# Altium project NI_ELVIS.PrjPCB
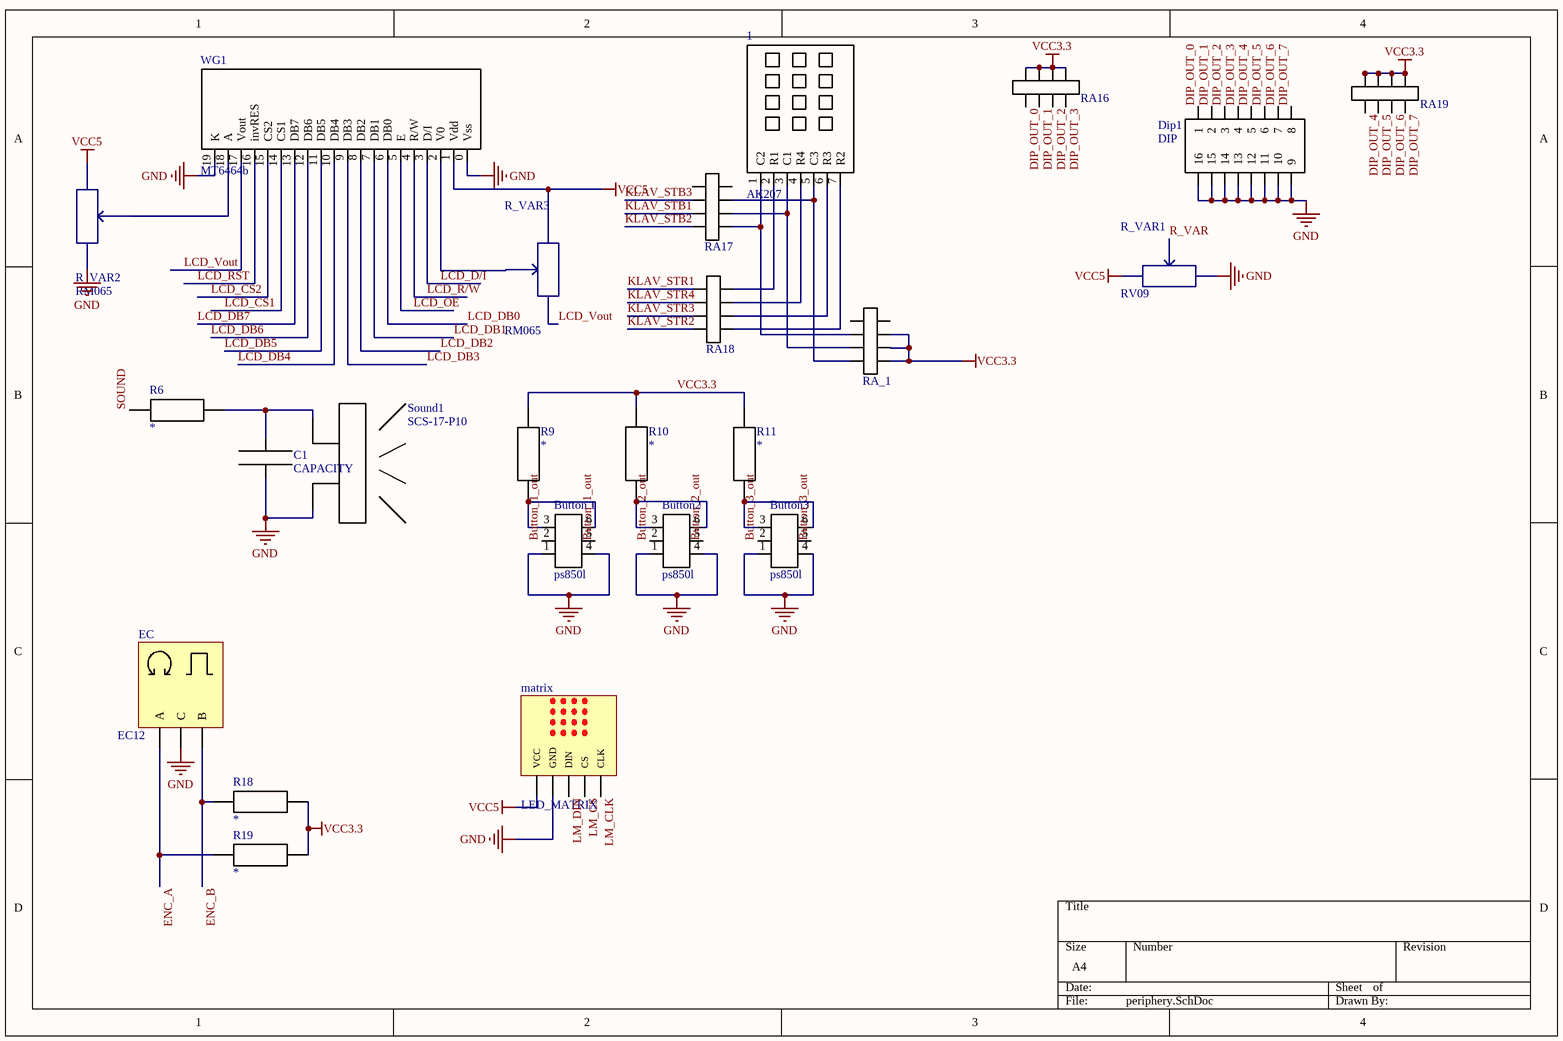
[diagram p0: periphery.SchDoc]
6 sheets, 90 parts. Net scope: global (net labels, ports and power ports of the same name join across sheets).
Board file: main_board.PcbDoc
Sheets:
  periphery.SchDoc
  power.SchDoc
  board_ports.SchDoc
  elv_connector.SchDoc
  7SEG.SchDoc
  main_connector.SchDoc

## Sheet periphery.SchDoc
size A4

### Parts
1  AK207  [AK-207]
Button2  ps850l  [ps850l]
Button3  ps850l  [ps850l]
Button_1  ps850l  [ps850l]
C1  CAPACITY  [R0805]
Dip1  DIP  [SWD1-8]
EC  EC12  [EC]
matrix  LED_MATRIX  [LED_MATRIX]
R6  *  [R0805]
R9  *  [R0805]
R10  *  [R0805]
R11  *  [R0805]
R18  *  [R0805]
R19  *  [R0805]
R_VAR1  RV09  [RV09]
R_VAR2  RM065  [RM065]
R_VAR3  RM065  [RM065]
RA16  Bourns CAT16-102J4LF_1  [CAT16-102J4_NEW]  (value not drawn)
RA17  Bourns CAT16-102J4LF_1  [CAT16-102J4_NEW]  (value not drawn)
RA18  Bourns CAT16-102J4LF_1  [CAT16-102J4_NEW]  (value not drawn)
RA19  Bourns CAT16-102J4LF_1  [CAT16-102J4_NEW]  (value not drawn)
RA_1  Bourns CAT16-102J4LF_1  [CAT16-102J4_NEW]  (value not drawn)
Sound1  SCS-17-P10  [SCS-17-P10]
WG1  MT6464b  [WG12864A]

### Nets
GND: Button2.1 Button2.4 Button3.1 Button3.4 Button_1.1 Button_1.4 C1.1 Dip1.9 Dip1.10 Dip1.11 Dip1.12 Dip1.13 Dip1.14 Dip1.15 Dip1.16 EC.2(C) matrix.2(GND) R_VAR1.3 R_VAR2.3 Sound1.0 WG1.0(Vss) WG1.19(K)
VCC3.3: R9.1 R10.1 R11.1 R18.2 R19.2 RA16.0 RA16.1 RA16.2 RA16.3 RA19.0 RA19.1 RA19.2 RA19.3 RA_1.5 RA_1.6 RA_1.7
VCC5: matrix.1(VCC) R_VAR1.1 R_VAR2.1 R_VAR3.3 WG1.1(Vdd)
Button_1_out: Button_1.2 Button_1.5
Button_2_out: Button2.2 Button2.5
Button_3_out: Button3.2 Button3.5
DIP_OUT_0: Dip1.1 RA16.7
DIP_OUT_1: Dip1.2 RA16.6
DIP_OUT_2: Dip1.3 RA16.5
DIP_OUT_3: Dip1.4 RA16.4
DIP_OUT_4: Dip1.5 RA19.7
DIP_OUT_5: Dip1.6 RA19.6
DIP_OUT_6: Dip1.7 RA19.5
DIP_OUT_7: Dip1.8 RA19.4
ENC_A: EC.1(A) R19.1
ENC_B: EC.3(B) R18.1
KLAV_STB1: RA17.2
KLAV_STB2: RA17.3
KLAV_STB3: RA17.1
KLAV_STR1: RA18.0
KLAV_STR2: RA18.3
KLAV_STR3: RA18.2
KLAV_STR4: RA18.1
LCD_CS1: WG1.14(CS1)
LCD_CS2: WG1.15(CS2)
LCD_D/I: WG1.3(D/I)
LCD_DB0: WG1.6(DB0)
LCD_DB1: WG1.7(DB1)
LCD_DB2: WG1.8(DB2)
LCD_DB3: WG1.9(DB3)
LCD_DB4: WG1.10(DB4)
LCD_DB5: WG1.11(DB5)
LCD_DB6: WG1.12(DB6)
LCD_DB7: WG1.13(DB7)
LCD_OE: WG1.5(E)
LCD_R/W: WG1.4(R/W)
LCD_RST: WG1.16(invRES)
LCD_Vout: R_VAR3.1 WG1.17(Vout)
LM_CLK: matrix.5(CLK)
LM_CS: matrix.4(CS)
LM_DIN: matrix.3(DIN)
R_VAR: R_VAR1.2
SOUND: R6.1
Net1_1: 1.1(C2) RA17.4 RA_1.2
Net1_2: 1.2(R1) RA18.7
Net1_3: 1.3(C1) RA17.5 RA_1.1
Net1_4: 1.4(R4) RA18.6
Net1_5: 1.5(C3) RA17.6 RA_1.0
Net1_6: 1.6(R3) RA18.5
Net1_7: 1.7(R2) RA18.4
NetButton2_3: Button2.3 Button2.6 R10.2
NetButton3_3: Button3.3 Button3.6 R11.2
NetButton_1_3: Button_1.3 Button_1.6 R9.2
NetC1_2: C1.2 R6.2 Sound1.1
NetR_VAR2_2: R_VAR2.2 WG1.18(A)
NetR_VAR3_2: R_VAR3.2 WG1.2(V0)

Not connected (* = marked no-connect by the designer): RA17 0 7; RA_1 3 4

### Library data of the parts
1 = AK-207
EC = EC12: EC12 rotary encoder
matrix = LED_MATRIX: led matrix, max7219 driver
R6 R9-R11 R18 R19 = R0805: Resistance: *
R_VAR2 R_VAR3 = RM065: trimming potentiometer

## Sheet power.SchDoc
size A4
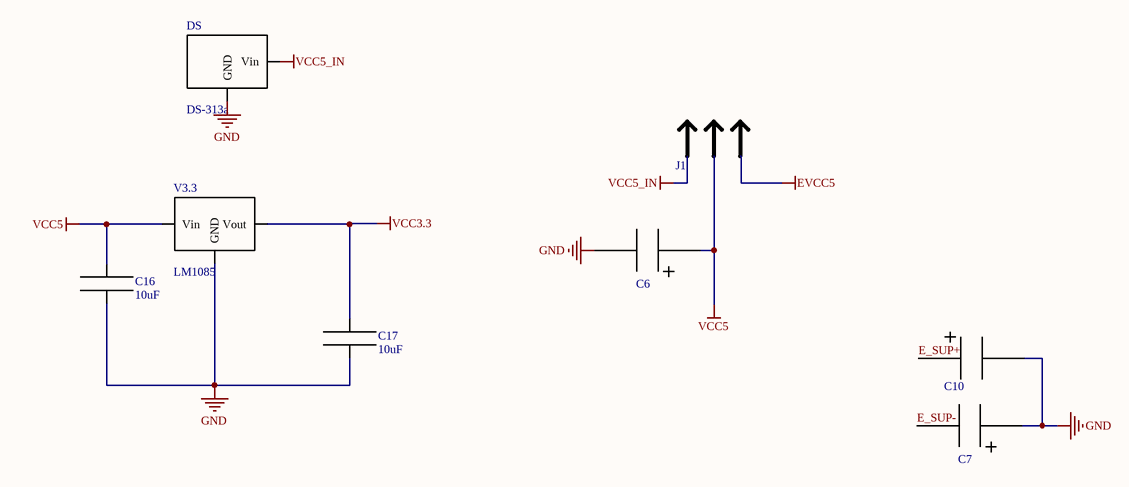
[diagram p1: power.SchDoc]

### Parts
C6  C_Ta  [C_Ta]  (value not drawn)
C7  C_Ta  [C_Ta]  (value not drawn)
C10  C_Ta  [C_Ta]  (value not drawn)
C16  10uF  [R0805]
C17  10uF  [R0805]
DS  DS-313a  [ds-313]
J1  JUMPER_SWITCH_2S  [JUMPER_SWITCH_2S]  (value not drawn)
V3.3  LM1085  [LM1085]

### Nets
EVCC5: J1.2
GND: C6.2 C7.1 C10.2 C16.2 C17.2 DS.0(GND) V3.3.0(GND)
VCC3.3: C17.1 V3.3.1(Vout)
VCC5: C6.1 C16.1 J1.0 V3.3.2(Vin)
VCC5_IN: DS.1(Vin) J1.1
E_SUP+: C10.1
E_SUP-: C7.2

### Library data of the parts
C6 C7 C10 = C_Ta: tantalum capacitor; capacity: *
C16 C17 = CAPACITY: Capacity: 10uF
J1 = JUMPER_SWITCH_2S: 2 state jumper switch

## Sheet board_ports.SchDoc
size A3
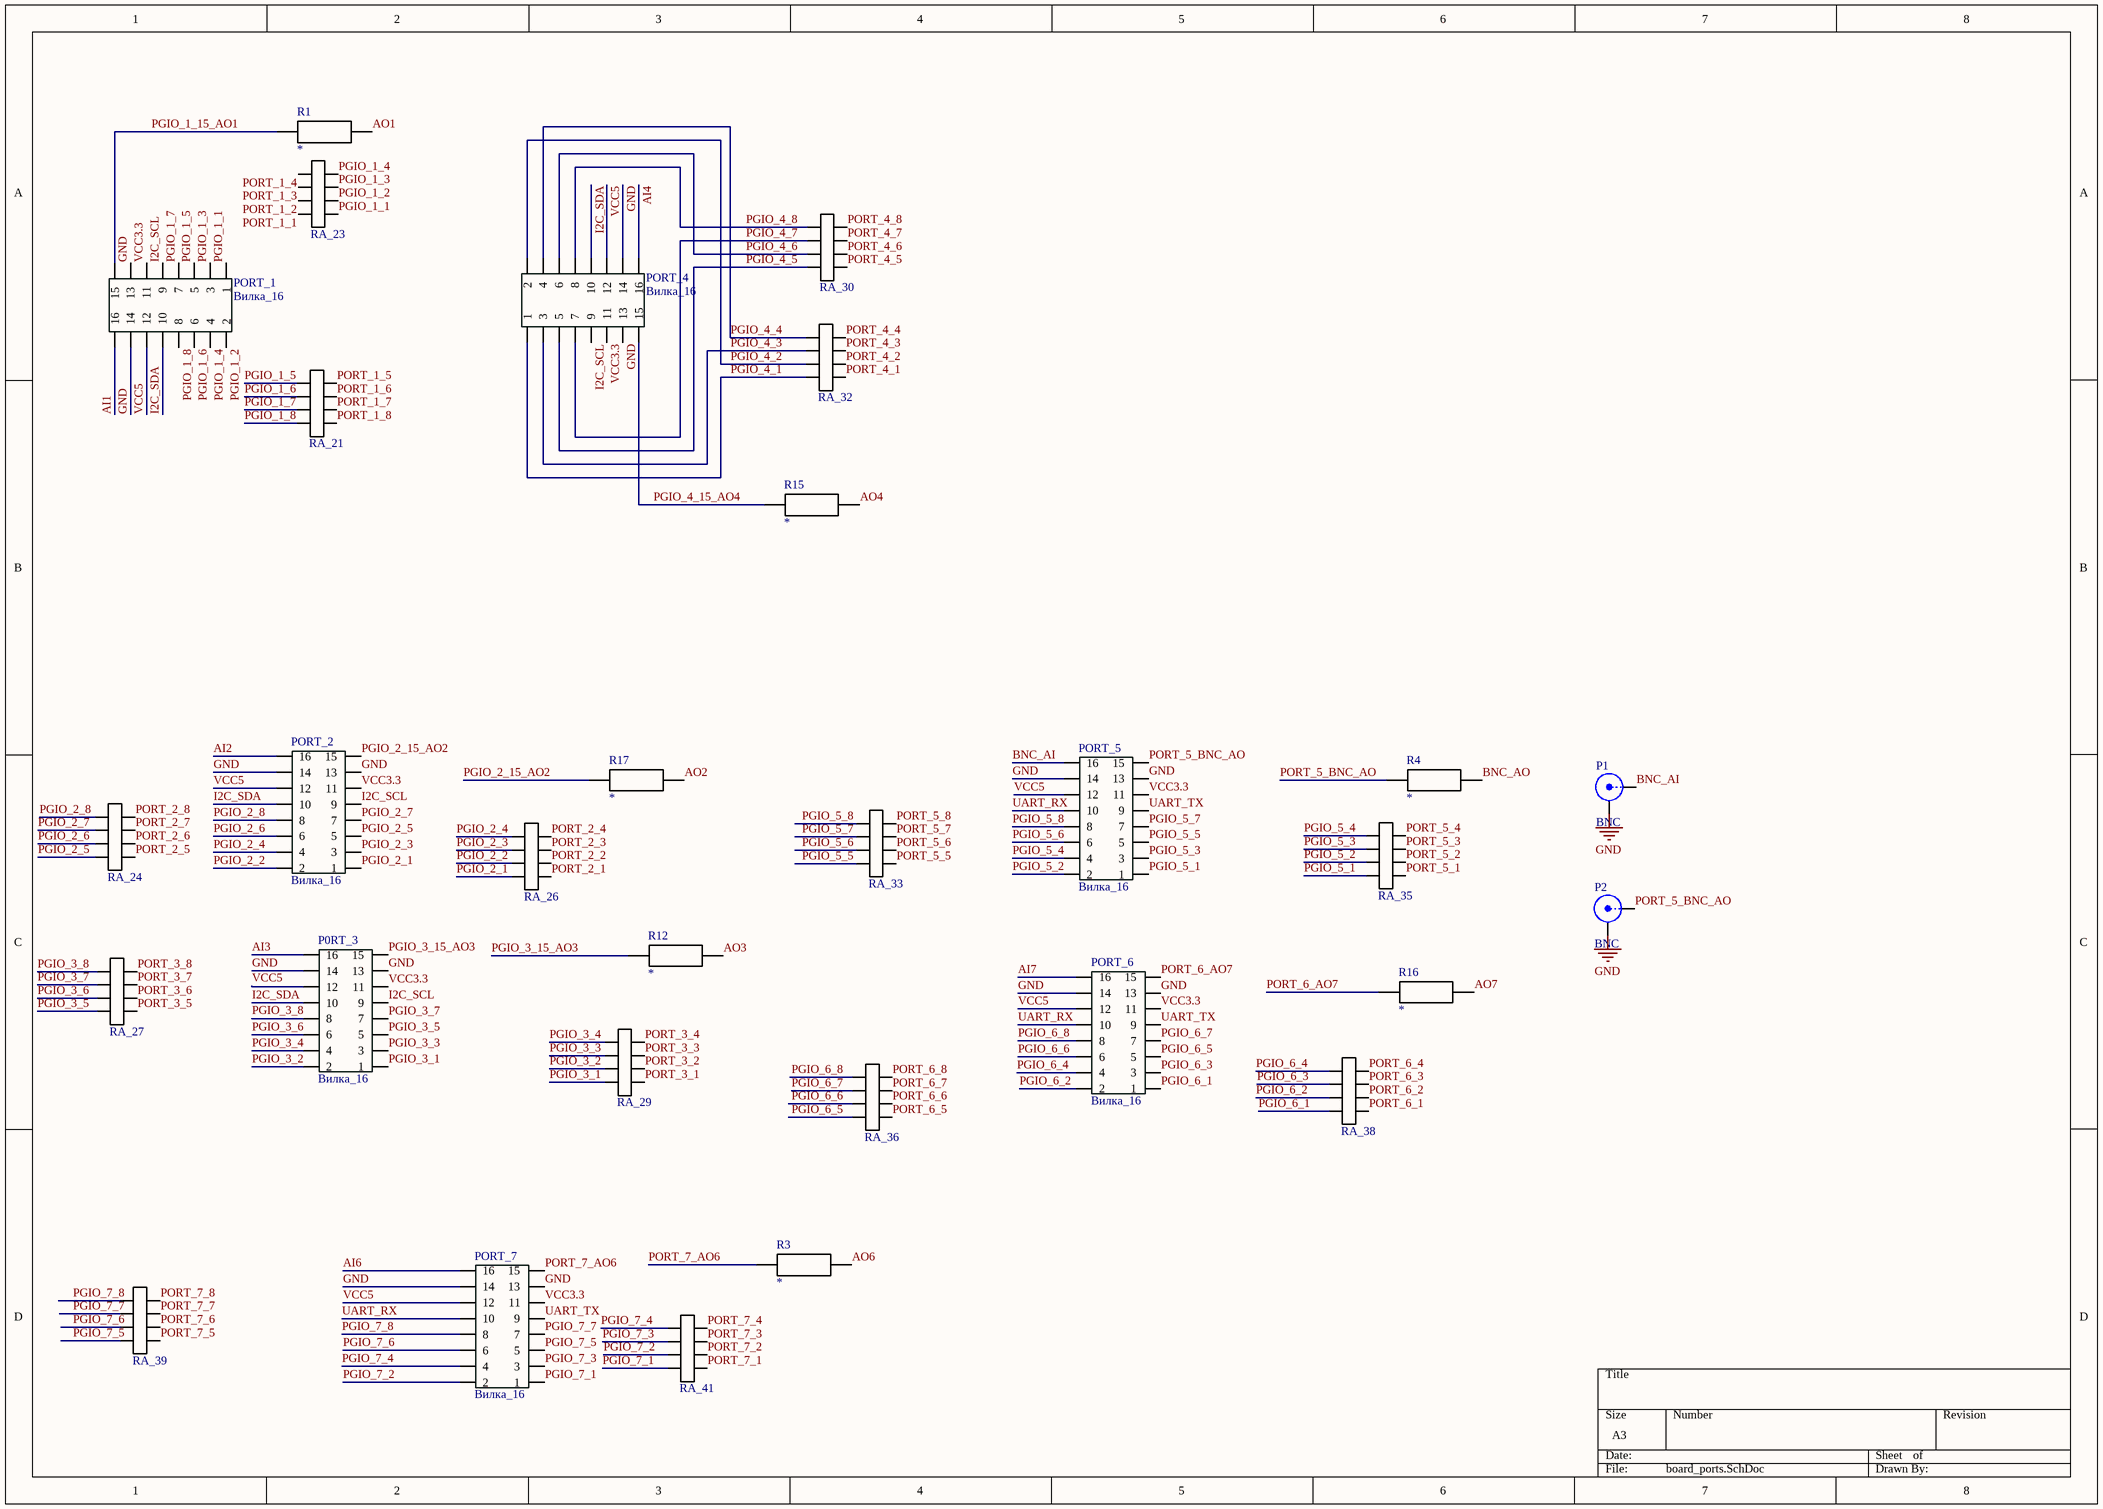
[diagram p2: board_ports.SchDoc]

### Parts
P0RT_3  Вилка_16  [DS1013-16]
P1  BNC  [BNC_RA CON]
P2  BNC  [BNC_RA CON]
PORT_1  Вилка_16  [DS1013-16]
PORT_2  Вилка_16  [DS1013-16]
PORT_4  Вилка_16  [DS1013-16]
PORT_5  Вилка_16  [DS1013-16]
PORT_6  Вилка_16  [DS1013-16]
PORT_7  Вилка_16  [DS1013-16]
R1  *  [R0805]
R3  *  [R0805]
R4  *  [R0805]
R12  *  [R0805]
R15  *  [R0805]
R16  *  [R0805]
R17  *  [R0805]
RA_21  Bourns CAT16-102J4LF_1  [CAT16-102J4_NEW]  (value not drawn)
RA_23  Bourns CAT16-102J4LF_1  [CAT16-102J4_NEW]  (value not drawn)
RA_24  Bourns CAT16-102J4LF_1  [CAT16-102J4_NEW]  (value not drawn)
RA_26  Bourns CAT16-102J4LF_1  [CAT16-102J4_NEW]  (value not drawn)
RA_27  Bourns CAT16-102J4LF_1  [CAT16-102J4_NEW]  (value not drawn)
RA_29  Bourns CAT16-102J4LF_1  [CAT16-102J4_NEW]  (value not drawn)
RA_30  Bourns CAT16-102J4LF_1  [CAT16-102J4_NEW]  (value not drawn)
RA_32  Bourns CAT16-102J4LF_1  [CAT16-102J4_NEW]  (value not drawn)
RA_33  Bourns CAT16-102J4LF_1  [CAT16-102J4_NEW]  (value not drawn)
RA_35  Bourns CAT16-102J4LF_1  [CAT16-102J4_NEW]  (value not drawn)
RA_36  Bourns CAT16-102J4LF_1  [CAT16-102J4_NEW]  (value not drawn)
RA_38  Bourns CAT16-102J4LF_1  [CAT16-102J4_NEW]  (value not drawn)
RA_39  Bourns CAT16-102J4LF_1  [CAT16-102J4_NEW]  (value not drawn)
RA_41  Bourns CAT16-102J4LF_1  [CAT16-102J4_NEW]  (value not drawn)

### Nets
GND: P0RT_3.13 P0RT_3.14 P1.2(Y) P2.2(Y) PORT_1.13 PORT_1.14 PORT_2.13 PORT_2.14 PORT_4.13 PORT_4.14 PORT_5.13 PORT_5.14 PORT_6.13 PORT_6.14 PORT_7.13 PORT_7.14
VCC3.3: P0RT_3.11 PORT_1.11 PORT_2.11 PORT_4.11 PORT_5.11 PORT_6.11 PORT_7.11
VCC5: P0RT_3.12 PORT_1.12 PORT_2.12 PORT_4.12 PORT_5.12 PORT_6.12 PORT_7.12
AI1: PORT_1.16
AI2: PORT_2.16
AI3: P0RT_3.16
AI4: PORT_4.16
AI6: PORT_7.16
AI7: PORT_6.16
AO1: R1.2
AO2: R17.2
AO3: R12.2
AO4: R15.2
AO6: R3.2
AO7: R16.2
BNC_AI: P1.1(X) PORT_5.16
BNC_AO: R4.2
I2C_SCL: P0RT_3.9 PORT_1.9 PORT_2.9 PORT_4.9
I2C_SDA: P0RT_3.10 PORT_1.10 PORT_2.10 PORT_4.10
PGIO_1_1: PORT_1.1 RA_23.7
PGIO_1_2: PORT_1.2 RA_23.6
PGIO_1_3: PORT_1.3 RA_23.5
PGIO_1_4: PORT_1.4 RA_23.4
PGIO_1_5: PORT_1.5 RA_21.3
PGIO_1_6: PORT_1.6 RA_21.2
PGIO_1_7: PORT_1.7 RA_21.1
PGIO_1_8: PORT_1.8 RA_21.0
PGIO_1_15_AO1: PORT_1.15 R1.1
PGIO_2_1: PORT_2.1 RA_26.4
PGIO_2_2: PORT_2.2 RA_26.5
PGIO_2_3: PORT_2.3 RA_26.6
PGIO_2_4: PORT_2.4 RA_26.7
PGIO_2_5: PORT_2.5 RA_24.0
PGIO_2_6: PORT_2.6 RA_24.1
PGIO_2_7: PORT_2.7 RA_24.2
PGIO_2_8: PORT_2.8 RA_24.3
PGIO_2_15_AO2: PORT_2.15 R17.1
PGIO_3_1: P0RT_3.1 RA_29.0
PGIO_3_2: P0RT_3.2 RA_29.1
PGIO_3_3: P0RT_3.3 RA_29.2
PGIO_3_4: P0RT_3.4 RA_29.3
PGIO_3_5: P0RT_3.5 RA_27.0
PGIO_3_6: P0RT_3.6 RA_27.1
PGIO_3_7: P0RT_3.7 RA_27.2
PGIO_3_8: P0RT_3.8 RA_27.3
PGIO_3_15_AO3: P0RT_3.15 R12.1
PGIO_4_1: PORT_4.1 RA_32.4
PGIO_4_2: PORT_4.2 RA_32.5
PGIO_4_3: PORT_4.3 RA_32.6
PGIO_4_4: PORT_4.4 RA_32.7
PGIO_4_5: PORT_4.5 RA_30.4
PGIO_4_6: PORT_4.6 RA_30.5
PGIO_4_7: PORT_4.7 RA_30.6
PGIO_4_8: PORT_4.8 RA_30.7
PGIO_4_15_AO4: PORT_4.15 R15.1
PGIO_5_1: PORT_5.1 RA_35.0
PGIO_5_2: PORT_5.2 RA_35.1
PGIO_5_3: PORT_5.3 RA_35.2
PGIO_5_4: PORT_5.4 RA_35.3
PGIO_5_5: PORT_5.5 RA_33.0
PGIO_5_6: PORT_5.6 RA_33.1
PGIO_5_7: PORT_5.7 RA_33.2
PGIO_5_8: PORT_5.8 RA_33.3
PGIO_6_1: PORT_6.1 RA_38.4
PGIO_6_2: PORT_6.2 RA_38.5
PGIO_6_3: PORT_6.3 RA_38.6
PGIO_6_4: PORT_6.4 RA_38.7
PGIO_6_5: PORT_6.5 RA_36.0
PGIO_6_6: PORT_6.6 RA_36.1
PGIO_6_7: PORT_6.7 RA_36.2
PGIO_6_8: PORT_6.8 RA_36.3
PGIO_7_1: PORT_7.1 RA_41.4
PGIO_7_2: PORT_7.2 RA_41.5
PGIO_7_3: PORT_7.3 RA_41.6
PGIO_7_4: PORT_7.4 RA_41.7
PGIO_7_5: PORT_7.5 RA_39.0
PGIO_7_6: PORT_7.6 RA_39.1
PGIO_7_7: PORT_7.7 RA_39.2
PGIO_7_8: PORT_7.8 RA_39.3
PORT_1_1: RA_23.0
PORT_1_2: RA_23.1
PORT_1_3: RA_23.2
PORT_1_4: RA_23.3
PORT_1_5: RA_21.4
PORT_1_6: RA_21.5
PORT_1_7: RA_21.6
PORT_1_8: RA_21.7
PORT_2_1: RA_26.3
PORT_2_2: RA_26.2
PORT_2_3: RA_26.1
PORT_2_4: RA_26.0
PORT_2_5: RA_24.7
PORT_2_6: RA_24.6
PORT_2_7: RA_24.5
PORT_2_8: RA_24.4
PORT_3_1: RA_29.7
PORT_3_2: RA_29.6
PORT_3_3: RA_29.5
PORT_3_4: RA_29.4
PORT_3_5: RA_27.7
PORT_3_6: RA_27.6
PORT_3_7: RA_27.5
PORT_3_8: RA_27.4
PORT_4_1: RA_32.3
PORT_4_2: RA_32.2
PORT_4_3: RA_32.1
PORT_4_4: RA_32.0
PORT_4_5: RA_30.3
PORT_4_6: RA_30.2
PORT_4_7: RA_30.1
PORT_4_8: RA_30.0
PORT_5_1: RA_35.7
PORT_5_2: RA_35.6
PORT_5_3: RA_35.5
PORT_5_4: RA_35.4
PORT_5_5: RA_33.7
PORT_5_6: RA_33.6
PORT_5_7: RA_33.5
PORT_5_8: RA_33.4
PORT_5_BNC_AO: P2.1(X) PORT_5.15 R4.1
PORT_6_1: RA_38.3
PORT_6_2: RA_38.2
PORT_6_3: RA_38.1
PORT_6_4: RA_38.0
PORT_6_5: RA_36.7
PORT_6_6: RA_36.6
PORT_6_7: RA_36.5
PORT_6_8: RA_36.4
PORT_6_AO7: PORT_6.15 R16.1
PORT_7_1: RA_41.3
PORT_7_2: RA_41.2
PORT_7_3: RA_41.1
PORT_7_4: RA_41.0
PORT_7_5: RA_39.7
PORT_7_6: RA_39.6
PORT_7_7: RA_39.5
PORT_7_8: RA_39.4
PORT_7_AO6: PORT_7.15 R3.1
UART_RX: PORT_5.10 PORT_6.10 PORT_7.10
UART_TX: PORT_5.9 PORT_6.9 PORT_7.9

### Library data of the parts
P0RT_3 PORT_1 PORT_2 PORT_4-PORT_7 = DS1013-16: 16_pin
P1 P2 = BNC: BNC Elbow Connector; LatestRevisionDate: 17-Jul-2002; LatestRevisionNote: Re-released for DXP Platform.; Publisher: Altium Limited
R1 R3 R4 R12 R15-R17 = R0805: Resistance: *

## Sheet elv_connector.SchDoc
size A4
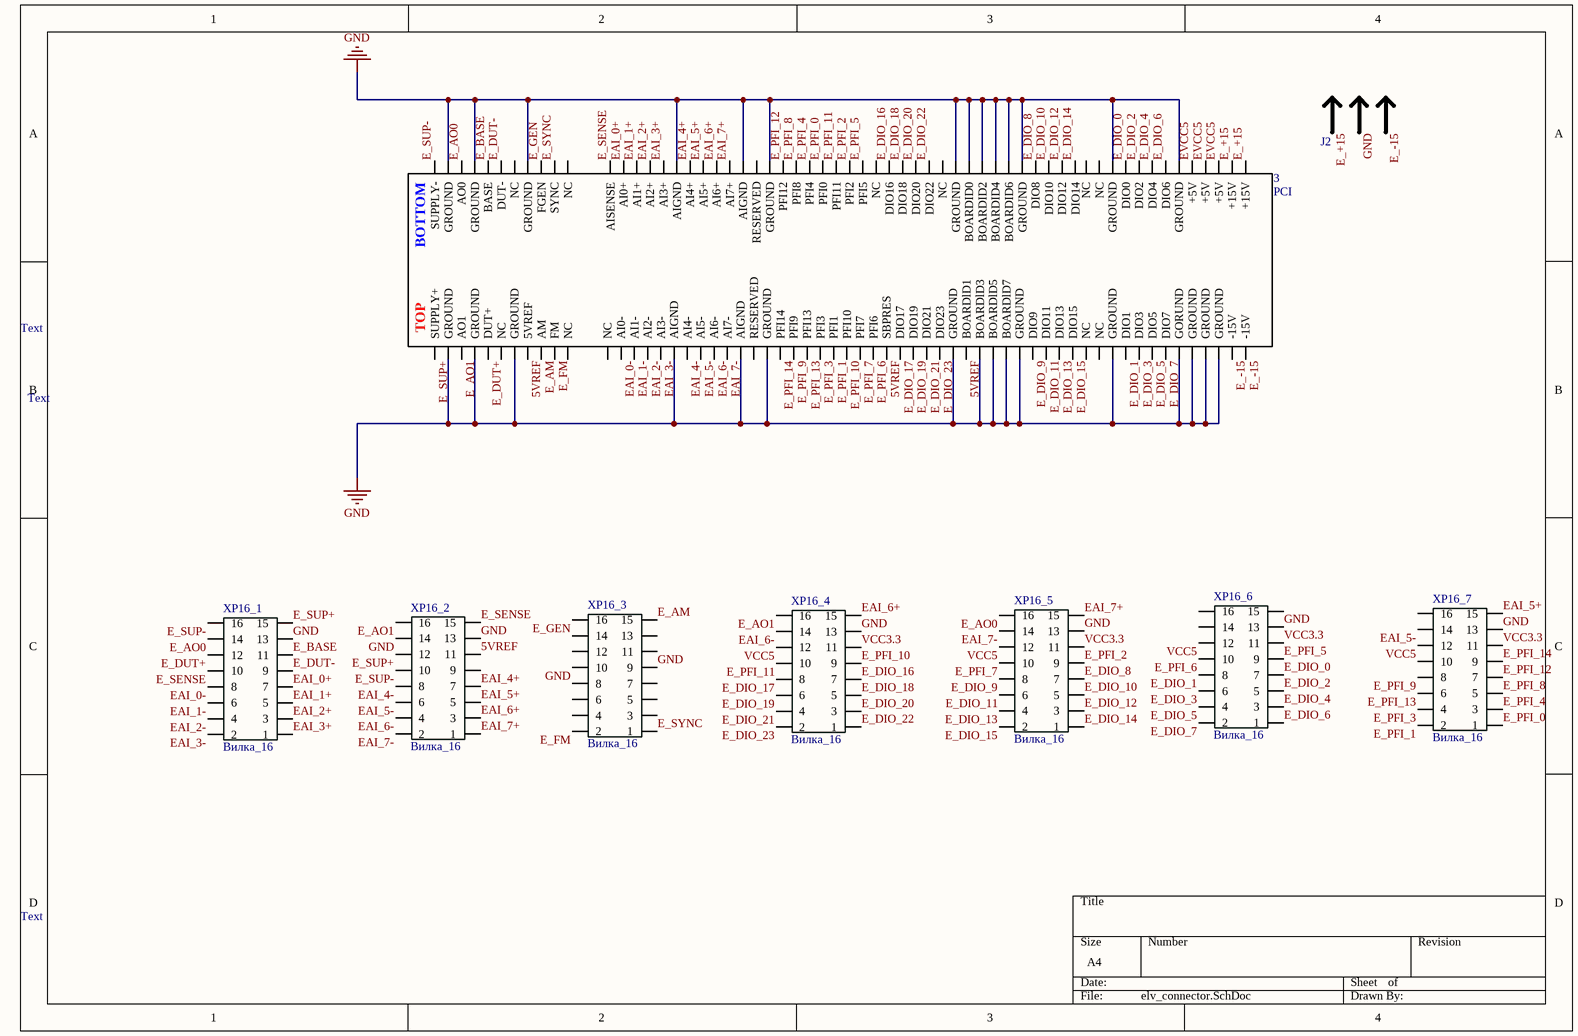
[diagram p3: elv_connector.SchDoc]

### Parts
3  PCI  [PCI-120]
J2  JUMPER_SWITCH_2S  [JUMPER_SWITCH_2S]  (value not drawn)
XP16_1  Вилка_16  [DS1013-16]
XP16_2  Вилка_16  [DS1013-16]
XP16_3  Вилка_16  [DS1013-16]
XP16_4  Вилка_16  [DS1013-16]
XP16_5  Вилка_16  [DS1013-16]
XP16_6  Вилка_16  [DS1013-16]
XP16_7  Вилка_16  [DS1013-16]

### Nets
EVCC5: 3.62(+5V) 3.63(+5V) 3.64(+5V)
GND: 3.1(GROUND) 3.3(GROUND) 3.6(GROUND) 3.16(AIGND) 3.21(AIGND) 3.23(GROUND) 3.37(GROUND) 3.39(BOARDlD3) 3.40(BOARDlD5) 3.41(BOARDlD7) 3.42(GROUND) 3.49(GROUND) 3.54(GORUND) 3.55(GROUND) 3.56(GROUND) 3.57(GROUND) 3.65(GROUND) 3.70(GROUND) 3.77(GROUND) 3.78(BOARDID6) 3.79(BOARDID4) 3.80(BOARDID2) 3.81(BOARDID0) 3.82(GROUND) 3.96(GROUND) 3.98(AIGND) 3.103(AIGND) 3.112(GROUND) 3.116(GROUND) 3.118(GROUND) J2.0 XP16_1.13 XP16_2.13 XP16_2.14 XP16_3.9 XP16_3.10 XP16_4.13 XP16_5.13 XP16_6.13 XP16_7.13
VCC3.3: XP16_4.11 XP16_5.11 XP16_6.11 XP16_7.11
VCC5: XP16_4.12 XP16_5.12 XP16_6.12 XP16_7.12
5VREF: 3.7(5VREF) 3.32(SBPRES) 3.38(BOARDlD1) XP16_2.11
E_+15: 3.60(+15V) 3.61(+15V) J2.1
E_-15: 3.58(-15V) 3.59(-15V) J2.2
E_AM: 3.8(AM) XP16_3.15
E_AO0: 3.117(AO0) XP16_1.14 XP16_5.16
E_AO1: 3.2(AO1) XP16_2.16 XP16_4.16
E_BASE: 3.115(BASE) XP16_1.11
E_DIO_0: 3.69(DIO0) XP16_6.7
E_DIO_1: 3.50(DIO1) XP16_6.8
E_DIO_2: 3.68(DIO2) XP16_6.5
E_DIO_3: 3.51(DIO3) XP16_6.6
E_DIO_4: 3.67(DIO4) XP16_6.3
E_DIO_5: 3.52(DIO5) XP16_6.4
E_DIO_6: 3.66(DIO6) XP16_6.1
E_DIO_7: 3.53(DIO7) XP16_6.2
E_DIO_8: 3.76(DIO8) XP16_5.7
E_DIO_9: 3.43(DIO9) XP16_5.8
E_DIO_10: 3.75(DIO10) XP16_5.5
E_DIO_11: 3.44(DIO11) XP16_5.6
E_DIO_12: 3.74(DIO12) XP16_5.3
E_DIO_13: 3.45(DIO13) XP16_5.4
E_DIO_14: 3.73(DIO14) XP16_5.1
E_DIO_15: 3.46(DIO15) XP16_5.2
E_DIO_16: 3.87(DIO16) XP16_4.7
E_DIO_17: 3.33(DIO17) XP16_4.8
E_DIO_18: 3.86(DIO18) XP16_4.5
E_DIO_19: 3.34(DIO19) XP16_4.6
E_DIO_20: 3.85(DIO20) XP16_4.3
E_DIO_21: 3.35(DIO21) XP16_4.4
E_DIO_22: 3.84(DIO22) XP16_4.1
E_DIO_23: 3.36(DIO23) XP16_4.2
E_DUT+: 3.4(DUT+) XP16_1.12
E_DUT-: 3.114(DUT-) XP16_1.9
E_FM: 3.9(FM) XP16_3.2
E_GEN: 3.111(FGEN) XP16_3.16
E_PFI_0: 3.92(PFI0) XP16_7.1
E_PFI_1: 3.28(PFI1) XP16_7.2
E_PFI_2: 3.90(PFI2) XP16_5.9
E_PFI_3: 3.27(PFI3) XP16_7.4
E_PFI_4: 3.93(PFI4) XP16_7.3
E_PFI_5: 3.89(PFI5) XP16_6.9
E_PFI_6: 3.31(PFI6) XP16_6.10
E_PFI_7: 3.30(PFI7) XP16_5.10
E_PFI_8: 3.94(PFI8) XP16_7.5
E_PFI_9: 3.25(PFI9) XP16_7.8
E_PFI_10: 3.29(PFI10) XP16_4.9
E_PFI_11: 3.91(PFI11) XP16_4.10
E_PFI_12: 3.95(PFI12) XP16_7.7
E_PFI_13: 3.26(PFI13) XP16_7.6
E_PFI_14: 3.24(PFI14) XP16_7.9
E_SENSE: 3.108(AISENSE) XP16_1.10 XP16_2.15
E_SUP+: 3.0(SUPPLY+) XP16_1.15 XP16_2.12
E_SUP-: 3.119(SUPPLY-) XP16_1.16 XP16_2.10
E_SYNC: 3.110(SYNC) XP16_3.1
EAI_0+: 3.107(AI0+) XP16_1.7
EAI_0-: 3.12(AI0-) XP16_1.8
EAI_1+: 3.106(AI1+) XP16_1.5
EAI_1-: 3.13(AI1-) XP16_1.6
EAI_2+: 3.105(AI2+) XP16_1.3
EAI_2-: 3.14(AI2-) XP16_1.4
EAI_3+: 3.104(AI3+) XP16_1.1
EAI_3-: 3.15(AI3-) XP16_1.2
EAI_4+: 3.102(AI4+) XP16_2.7
EAI_4-: 3.17(AI4-) XP16_2.8
EAI_5+: 3.101(AI5+) XP16_2.5 XP16_7.15
EAI_5-: 3.18(AI5-) XP16_2.6 XP16_7.14
EAI_6+: 3.100(AI6+) XP16_2.3 XP16_4.15
EAI_6-: 3.19(AI6-) XP16_2.4 XP16_4.14
EAI_7+: 3.99(AI7+) XP16_2.1 XP16_5.15
EAI_7-: 3.20(AI7-) XP16_2.2 XP16_5.14

Not connected (* = marked no-connect by the designer): 3 5(NC) 10(NC) 11(NC) 22(RESERVED) 47(NC) 48(NC) 71(NC) 72(NC) 83(NC) 88(NC) 97(RESERVED) 109(NC) 113(NC); XP16_2 9; XP16_3 3 4 5 6 7 8 11 12 13 14; XP16_6 14 15 16; XP16_7 10 16

### Notes on the sheet
- Text
- (in symbol PCI) BOTTOM; TOP

### Library data of the parts
J2 = JUMPER_SWITCH_2S: 2 state jumper switch
XP16_1-XP16_7 = DS1013-16: 16_pin

## Sheet 7SEG.SchDoc
size A4
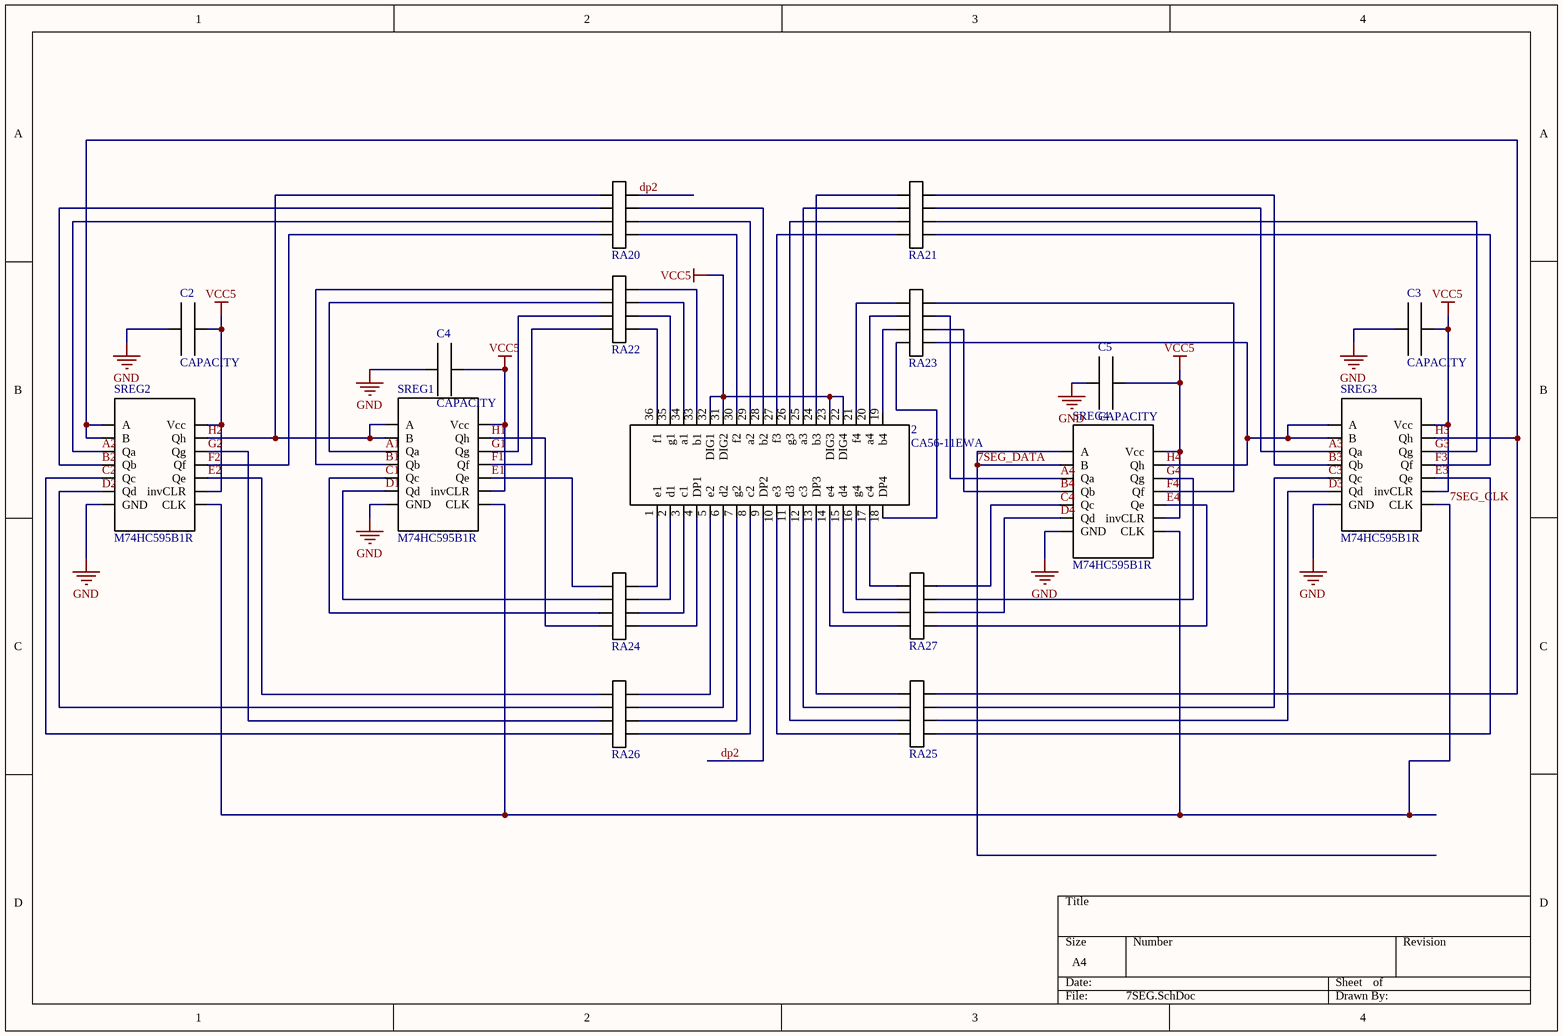
[diagram p4: 7SEG.SchDoc]

### Parts
2  CA56-11EWA  [CA56-11EWA]
C2  CAPACITY  [R0805]
C3  CAPACITY  [R0805]
C4  CAPACITY  [R0805]
C5  CAPACITY  [R0805]
RA20  Bourns CAT16-102J4LF_1  [CAT16-102J4_NEW]  (value not drawn)
RA21  Bourns CAT16-102J4LF_1  [CAT16-102J4_NEW]  (value not drawn)
RA22  Bourns CAT16-102J4LF_1  [CAT16-102J4_NEW]  (value not drawn)
RA23  Bourns CAT16-102J4LF_1  [CAT16-102J4_NEW]  (value not drawn)
RA24  Bourns CAT16-102J4LF_1  [CAT16-102J4_NEW]  (value not drawn)
RA25  Bourns CAT16-102J4LF_1  [CAT16-102J4_NEW]  (value not drawn)
RA26  Bourns CAT16-102J4LF_1  [CAT16-102J4_NEW]  (value not drawn)
RA27  Bourns CAT16-102J4LF_1  [CAT16-102J4_NEW]  (value not drawn)
SREG1  M74HC595B1R  [SN74HC164DRX]
SREG2  M74HC595B1R  [SN74HC164DRX]
SREG3  M74HC595B1R  [SN74HC164DRX]
SREG4  M74HC595B1R  [SN74HC164DRX]

### Nets
GND: C2.1 C3.1 C4.1 C5.1 SREG1.7(GND) SREG2.7(GND) SREG3.7(GND) SREG4.7(GND)
VCC5: 2.22(DIG4) 2.23(DIG3) 2.31(DIG2) 2.32(DIG1) C2.2 C3.2 C4.2 C5.2 SREG1.9(invCLR) SREG1.14(Vcc) SREG2.9(invCLR) SREG2.14(Vcc) SREG3.9(invCLR) SREG3.14(Vcc) SREG4.9(invCLR) SREG4.14(Vcc)
7SEG_CLK: SREG1.8(CLK) SREG2.8(CLK) SREG3.8(CLK) SREG4.8(CLK)
7SEG_DATA: SREG4.1(A) SREG4.2(B)
A1: RA22.2 SREG1.3(Qa)
A2: RA20.6 SREG2.3(Qa)
A3: RA21.2 SREG3.3(Qa)
A4: RA23.2 SREG4.3(Qa)
B1: RA22.3 SREG1.4(Qb)
B2: RA20.5 SREG2.4(Qb)
B3: RA21.3 SREG3.4(Qb)
B4: RA23.1 SREG4.4(Qb)
C1: RA24.1 SREG1.5(Qc)
C2: RA26.3 SREG2.5(Qc)
C3: RA25.5 SREG3.5(Qc)
C4: RA27.7 SREG4.5(Qc)
D1: RA24.2 SREG1.6(Qd)
D2: RA26.1 SREG2.6(Qd)
D3: RA25.6 SREG3.6(Qd)
D4: RA27.5 SREG4.6(Qd)
dp2: 2.9(DP2) RA20.3
E1: RA24.3 SREG1.10(Qe)
E2: RA26.0 SREG2.10(Qe)
E3: RA25.7 SREG3.10(Qe)
E4: RA27.4 SREG4.10(Qe)
F1: RA22.0 SREG1.11(Qf)
F2: RA20.7 SREG2.11(Qf)
F3: RA21.0 SREG3.11(Qf)
F4: RA23.3 SREG4.11(Qf)
G1: RA22.1 SREG1.12(Qg)
G2: RA26.2 SREG2.12(Qg)
G3: RA21.1 SREG3.12(Qg)
G4: RA27.6 SREG4.12(Qg)
H1: RA24.0 SREG1.13(Qh)
H2: RA20.4 SREG1.1(A) SREG1.2(B) SREG2.13(Qh)
H3: RA25.4 SREG2.1(A) SREG2.2(B) SREG3.13(Qh)
H4: RA23.0 SREG3.1(A) SREG3.2(B) SREG4.13(Qh)
Net2_1: 2.1(e1) RA24.4
Net2_2: 2.2(d1) RA24.5
Net2_3: 2.3(c1) RA24.6
Net2_4: 2.4(DP1) RA24.7
Net2_5: 2.5(e2) RA26.7
Net2_6: 2.6(d2) RA26.6
Net2_7: 2.7(g2) RA26.5
Net2_8: 2.8(c2) RA26.4
Net2_10: 2.10(e3) RA25.0
Net2_11: 2.11(d3) RA25.1
Net2_12: 2.12(c3) RA25.2
Net2_13: 2.13(DP3) RA25.3
Net2_14: 2.14(e4) RA27.3
Net2_15: 2.15(d4) RA27.2
Net2_16: 2.16(g4) RA27.1
Net2_17: 2.17(c4) RA27.0
Net2_18: 2.18(DP4) RA23.7
Net2_19: 2.19(b4) RA23.6
Net2_20: 2.20(a4) RA23.5
Net2_21: 2.21(f4) RA23.4
Net2_24: 2.24(b3) RA21.4
Net2_25: 2.25(a3) RA21.5
Net2_26: 2.26(g3) RA21.6
Net2_27: 2.27(f3) RA21.7
Net2_28: 2.28(b2) RA20.2
Net2_29: 2.29(a2) RA20.1
Net2_30: 2.30(f2) RA20.0
Net2_33: 2.33(b1) RA22.4
Net2_34: 2.34(a1) RA22.5
Net2_35: 2.35(g1) RA22.6
Net2_36: 2.36(f1) RA22.7

## Sheet main_connector.SchDoc
size A4
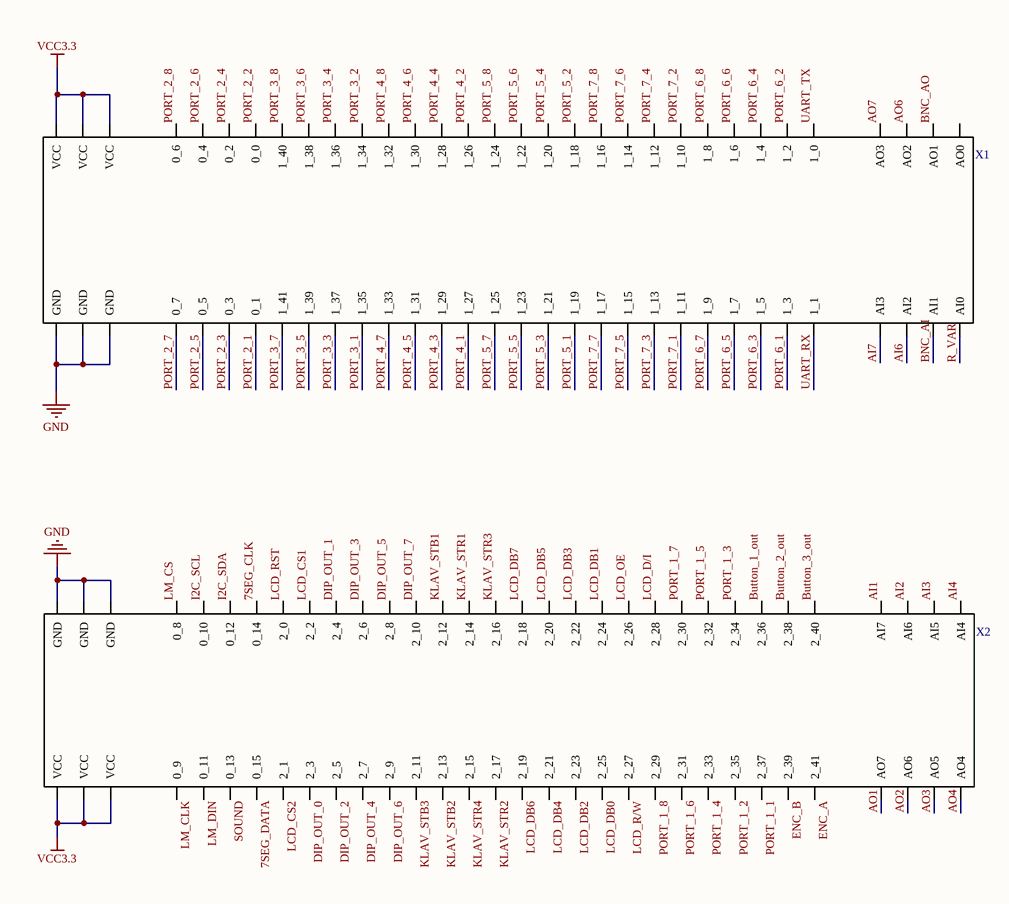
[diagram p5: main_connector.SchDoc]

### Parts
X1  CONNECTOR_TOP  [Connector]  (value not drawn)
X2  CONNECTOR_BOTTOM  [Connector]  (value not drawn)

### Nets
GND: X1.61(GND) X1.62(GND) X1.63(GND) X2.0(GND) X2.1(GND) X2.2(GND)
VCC3.3: X1.0(VCC) X1.1(VCC) X1.2(VCC) X2.61(VCC) X2.62(VCC) X2.63(VCC)
7SEG_CLK: X2.6(0_14)
7SEG_DATA: X2.57(0_15)
AI1: X2.28(AI7)
AI2: X2.29(AI6)
AI3: X2.30(AI5)
AI4: X2.31(AI4)
AI6: X1.34(AI2)
AI7: X1.35(AI3)
AO1: X2.35(AO7)
AO2: X2.34(AO6)
AO3: X2.33(AO5)
AO4: X2.32(AO4)
AO6: X1.29(AO2)
AO7: X1.28(AO3)
BNC_AI: X1.33(AI1)
BNC_AO: X1.30(AO1)
Button_1_out: X2.25(2_36)
Button_2_out: X2.26(2_38)
Button_3_out: X2.27(2_40)
DIP_OUT_0: X2.55(2_3)
DIP_OUT_1: X2.9(2_4)
DIP_OUT_2: X2.54(2_5)
DIP_OUT_3: X2.10(2_6)
DIP_OUT_4: X2.53(2_7)
DIP_OUT_5: X2.11(2_8)
DIP_OUT_6: X2.52(2_9)
DIP_OUT_7: X2.12(2_10)
ENC_A: X2.36(2_41)
ENC_B: X2.37(2_39)
I2C_SCL: X2.4(0_10)
I2C_SDA: X2.5(0_12)
KLAV_STB1: X2.13(2_12)
KLAV_STB2: X2.50(2_13)
KLAV_STB3: X2.51(2_11)
KLAV_STR1: X2.14(2_14)
KLAV_STR2: X2.48(2_17)
KLAV_STR3: X2.15(2_16)
KLAV_STR4: X2.49(2_15)
LCD_CS1: X2.8(2_2)
LCD_CS2: X2.56(2_1)
LCD_D/I: X2.21(2_28)
LCD_DB0: X2.44(2_25)
LCD_DB1: X2.19(2_24)
LCD_DB2: X2.45(2_23)
LCD_DB3: X2.18(2_22)
LCD_DB4: X2.46(2_21)
LCD_DB5: X2.17(2_20)
LCD_DB6: X2.47(2_19)
LCD_DB7: X2.16(2_18)
LCD_OE: X2.20(2_26)
LCD_R/W: X2.43(2_27)
LCD_RST: X2.7(2_0)
LM_CLK: X2.60(0_9)
LM_CS: X2.3(0_8)
LM_DIN: X2.59(0_11)
PORT_1_1: X2.38(2_37)
PORT_1_2: X2.39(2_35)
PORT_1_3: X2.24(2_34)
PORT_1_4: X2.40(2_33)
PORT_1_5: X2.23(2_32)
PORT_1_6: X2.41(2_31)
PORT_1_7: X2.22(2_30)
PORT_1_8: X2.42(2_29)
PORT_2_1: X1.57(0_1)
PORT_2_2: X1.6(0_0)
PORT_2_3: X1.58(0_3)
PORT_2_4: X1.5(0_2)
PORT_2_5: X1.59(0_5)
PORT_2_6: X1.4(0_4)
PORT_2_7: X1.60(0_7)
PORT_2_8: X1.3(0_6)
PORT_3_1: X1.53(1_35)
PORT_3_2: X1.10(1_34)
PORT_3_3: X1.54(1_37)
PORT_3_4: X1.9(1_36)
PORT_3_5: X1.55(1_39)
PORT_3_6: X1.8(1_38)
PORT_3_7: X1.56(1_41)
PORT_3_8: X1.7(1_40)
PORT_4_1: X1.49(1_27)
PORT_4_2: X1.14(1_26)
PORT_4_3: X1.50(1_29)
PORT_4_4: X1.13(1_28)
PORT_4_5: X1.51(1_31)
PORT_4_6: X1.12(1_30)
PORT_4_7: X1.52(1_33)
PORT_4_8: X1.11(1_32)
PORT_5_1: X1.45(1_19)
PORT_5_2: X1.18(1_18)
PORT_5_3: X1.46(1_21)
PORT_5_4: X1.17(1_20)
PORT_5_5: X1.47(1_23)
PORT_5_6: X1.16(1_22)
PORT_5_7: X1.48(1_25)
PORT_5_8: X1.15(1_24)
PORT_6_1: X1.37(1_3)
PORT_6_2: X1.26(1_2)
PORT_6_3: X1.38(1_5)
PORT_6_4: X1.25(1_4)
PORT_6_5: X1.39(1_7)
PORT_6_6: X1.24(1_6)
PORT_6_7: X1.40(1_9)
PORT_6_8: X1.23(1_8)
PORT_7_1: X1.41(1_11)
PORT_7_2: X1.22(1_10)
PORT_7_3: X1.42(1_13)
PORT_7_4: X1.21(1_12)
PORT_7_5: X1.43(1_15)
PORT_7_6: X1.20(1_14)
PORT_7_7: X1.44(1_17)
PORT_7_8: X1.19(1_16)
R_VAR: X1.32(AI0)
SOUND: X2.58(0_13)
UART_RX: X1.36(1_1)
UART_TX: X1.27(1_0)

Not connected (* = marked no-connect by the designer): X1 31(AO0)

### Library data of the parts
X1 = CONNECTOR_TOP: control board connector
X2 = CONNECTOR_BOTTOM: control board connector

## Nets that join several sheets
EVCC5: power (J1.2), elv_connector (3.62 3.63 3.64)
GND: periphery (22 pins), power (7 pins), board_ports (16 pins), elv_connector (40 pins), 7SEG (8 pins), main_connector (6 pins)
VCC3.3: periphery (16 pins), power (C17.1 V3.3.1), board_ports (7 pins), elv_connector (XP16_4.11 XP16_5.11 XP16_6.11 XP16_7.11), main_connector (6 pins)
VCC5: periphery (5 pins), power (C6.1 C16.1 J1.0 V3.3.2), board_ports (7 pins), elv_connector (XP16_4.12 XP16_5.12 XP16_6.12 XP16_7.12), 7SEG (16 pins)
7SEG_CLK: 7SEG (SREG1.8 SREG2.8 SREG3.8 SREG4.8), main_connector (X2.6)
7SEG_DATA: 7SEG (SREG4.1 SREG4.2), main_connector (X2.57)
AI1: board_ports (PORT_1.16), main_connector (X2.28)
AI2: board_ports (PORT_2.16), main_connector (X2.29)
AI3: board_ports (P0RT_3.16), main_connector (X2.30)
AI4: board_ports (PORT_4.16), main_connector (X2.31)
AI6: board_ports (PORT_7.16), main_connector (X1.34)
AI7: board_ports (PORT_6.16), main_connector (X1.35)
AO1: board_ports (R1.2), main_connector (X2.35)
AO2: board_ports (R17.2), main_connector (X2.34)
AO3: board_ports (R12.2), main_connector (X2.33)
AO4: board_ports (R15.2), main_connector (X2.32)
AO6: board_ports (R3.2), main_connector (X1.29)
AO7: board_ports (R16.2), main_connector (X1.28)
BNC_AI: board_ports (P1.1 PORT_5.16), main_connector (X1.33)
BNC_AO: board_ports (R4.2), main_connector (X1.30)
Button_1_out: periphery (Button_1.2 Button_1.5), main_connector (X2.25)
Button_2_out: periphery (Button2.2 Button2.5), main_connector (X2.26)
Button_3_out: periphery (Button3.2 Button3.5), main_connector (X2.27)
DIP_OUT_0: periphery (Dip1.1 RA16.7), main_connector (X2.55)
DIP_OUT_1: periphery (Dip1.2 RA16.6), main_connector (X2.9)
DIP_OUT_2: periphery (Dip1.3 RA16.5), main_connector (X2.54)
DIP_OUT_3: periphery (Dip1.4 RA16.4), main_connector (X2.10)
DIP_OUT_4: periphery (Dip1.5 RA19.7), main_connector (X2.53)
DIP_OUT_5: periphery (Dip1.6 RA19.6), main_connector (X2.11)
DIP_OUT_6: periphery (Dip1.7 RA19.5), main_connector (X2.52)
DIP_OUT_7: periphery (Dip1.8 RA19.4), main_connector (X2.12)
E_SUP+: power (C10.1), elv_connector (3.0 XP16_1.15 XP16_2.12)
E_SUP-: power (C7.2), elv_connector (3.119 XP16_1.16 XP16_2.10)
ENC_A: periphery (EC.1 R19.1), main_connector (X2.36)
ENC_B: periphery (EC.3 R18.1), main_connector (X2.37)
I2C_SCL: board_ports (P0RT_3.9 PORT_1.9 PORT_2.9 PORT_4.9), main_connector (X2.4)
I2C_SDA: board_ports (P0RT_3.10 PORT_1.10 PORT_2.10 PORT_4.10), main_connector (X2.5)
KLAV_STB1: periphery (RA17.2), main_connector (X2.13)
KLAV_STB2: periphery (RA17.3), main_connector (X2.50)
KLAV_STB3: periphery (RA17.1), main_connector (X2.51)
KLAV_STR1: periphery (RA18.0), main_connector (X2.14)
KLAV_STR2: periphery (RA18.3), main_connector (X2.48)
KLAV_STR3: periphery (RA18.2), main_connector (X2.15)
KLAV_STR4: periphery (RA18.1), main_connector (X2.49)
LCD_CS1: periphery (WG1.14), main_connector (X2.8)
LCD_CS2: periphery (WG1.15), main_connector (X2.56)
LCD_D/I: periphery (WG1.3), main_connector (X2.21)
LCD_DB0: periphery (WG1.6), main_connector (X2.44)
LCD_DB1: periphery (WG1.7), main_connector (X2.19)
LCD_DB2: periphery (WG1.8), main_connector (X2.45)
LCD_DB3: periphery (WG1.9), main_connector (X2.18)
LCD_DB4: periphery (WG1.10), main_connector (X2.46)
LCD_DB5: periphery (WG1.11), main_connector (X2.17)
LCD_DB6: periphery (WG1.12), main_connector (X2.47)
LCD_DB7: periphery (WG1.13), main_connector (X2.16)
LCD_OE: periphery (WG1.5), main_connector (X2.20)
LCD_R/W: periphery (WG1.4), main_connector (X2.43)
LCD_RST: periphery (WG1.16), main_connector (X2.7)
LM_CLK: periphery (matrix.5), main_connector (X2.60)
LM_CS: periphery (matrix.4), main_connector (X2.3)
LM_DIN: periphery (matrix.3), main_connector (X2.59)
PORT_1_1: board_ports (RA_23.0), main_connector (X2.38)
PORT_1_2: board_ports (RA_23.1), main_connector (X2.39)
PORT_1_3: board_ports (RA_23.2), main_connector (X2.24)
PORT_1_4: board_ports (RA_23.3), main_connector (X2.40)
PORT_1_5: board_ports (RA_21.4), main_connector (X2.23)
PORT_1_6: board_ports (RA_21.5), main_connector (X2.41)
PORT_1_7: board_ports (RA_21.6), main_connector (X2.22)
PORT_1_8: board_ports (RA_21.7), main_connector (X2.42)
PORT_2_1: board_ports (RA_26.3), main_connector (X1.57)
PORT_2_2: board_ports (RA_26.2), main_connector (X1.6)
PORT_2_3: board_ports (RA_26.1), main_connector (X1.58)
PORT_2_4: board_ports (RA_26.0), main_connector (X1.5)
PORT_2_5: board_ports (RA_24.7), main_connector (X1.59)
PORT_2_6: board_ports (RA_24.6), main_connector (X1.4)
PORT_2_7: board_ports (RA_24.5), main_connector (X1.60)
PORT_2_8: board_ports (RA_24.4), main_connector (X1.3)
PORT_3_1: board_ports (RA_29.7), main_connector (X1.53)
PORT_3_2: board_ports (RA_29.6), main_connector (X1.10)
PORT_3_3: board_ports (RA_29.5), main_connector (X1.54)
PORT_3_4: board_ports (RA_29.4), main_connector (X1.9)
PORT_3_5: board_ports (RA_27.7), main_connector (X1.55)
PORT_3_6: board_ports (RA_27.6), main_connector (X1.8)
PORT_3_7: board_ports (RA_27.5), main_connector (X1.56)
PORT_3_8: board_ports (RA_27.4), main_connector (X1.7)
PORT_4_1: board_ports (RA_32.3), main_connector (X1.49)
PORT_4_2: board_ports (RA_32.2), main_connector (X1.14)
PORT_4_3: board_ports (RA_32.1), main_connector (X1.50)
PORT_4_4: board_ports (RA_32.0), main_connector (X1.13)
PORT_4_5: board_ports (RA_30.3), main_connector (X1.51)
PORT_4_6: board_ports (RA_30.2), main_connector (X1.12)
PORT_4_7: board_ports (RA_30.1), main_connector (X1.52)
PORT_4_8: board_ports (RA_30.0), main_connector (X1.11)
PORT_5_1: board_ports (RA_35.7), main_connector (X1.45)
PORT_5_2: board_ports (RA_35.6), main_connector (X1.18)
PORT_5_3: board_ports (RA_35.5), main_connector (X1.46)
PORT_5_4: board_ports (RA_35.4), main_connector (X1.17)
PORT_5_5: board_ports (RA_33.7), main_connector (X1.47)
PORT_5_6: board_ports (RA_33.6), main_connector (X1.16)
PORT_5_7: board_ports (RA_33.5), main_connector (X1.48)
PORT_5_8: board_ports (RA_33.4), main_connector (X1.15)
PORT_6_1: board_ports (RA_38.3), main_connector (X1.37)
PORT_6_2: board_ports (RA_38.2), main_connector (X1.26)
PORT_6_3: board_ports (RA_38.1), main_connector (X1.38)
PORT_6_4: board_ports (RA_38.0), main_connector (X1.25)
PORT_6_5: board_ports (RA_36.7), main_connector (X1.39)
PORT_6_6: board_ports (RA_36.6), main_connector (X1.24)
PORT_6_7: board_ports (RA_36.5), main_connector (X1.40)
PORT_6_8: board_ports (RA_36.4), main_connector (X1.23)
PORT_7_1: board_ports (RA_41.3), main_connector (X1.41)
PORT_7_2: board_ports (RA_41.2), main_connector (X1.22)
PORT_7_3: board_ports (RA_41.1), main_connector (X1.42)
PORT_7_4: board_ports (RA_41.0), main_connector (X1.21)
PORT_7_5: board_ports (RA_39.7), main_connector (X1.43)
PORT_7_6: board_ports (RA_39.6), main_connector (X1.20)
PORT_7_7: board_ports (RA_39.5), main_connector (X1.44)
PORT_7_8: board_ports (RA_39.4), main_connector (X1.19)
R_VAR: periphery (R_VAR1.2), main_connector (X1.32)
SOUND: periphery (R6.1), main_connector (X2.58)
UART_RX: board_ports (PORT_5.10 PORT_6.10 PORT_7.10), main_connector (X1.36)
UART_TX: board_ports (PORT_5.9 PORT_6.9 PORT_7.9), main_connector (X1.27)